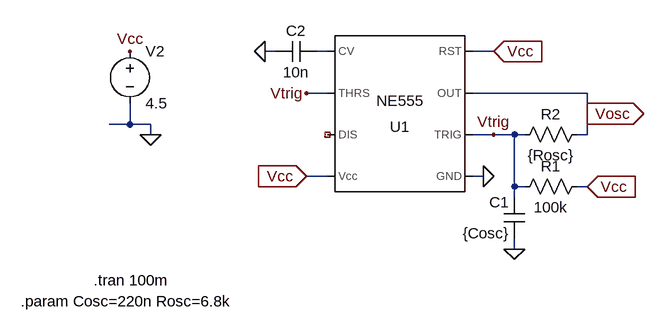
[diagram p0: schematic 555sim.asc]
555sim.asc, the LTspice schematic file:
Version 4
SHEET 1 880 680
WIRE 0 -32 -16 -32
WIRE 80 -32 64 -32
WIRE 336 -32 304 -32
WIRE 80 32 48 32
WIRE 480 32 304 32
WIRE 480 64 480 32
WIRE -224 80 -224 48
WIRE -224 80 -256 80
WIRE -192 80 -224 80
WIRE -192 96 -192 80
WIRE 336 96 304 96
WIRE 368 96 336 96
WIRE 384 96 368 96
WIRE 480 96 480 64
WIRE 480 96 464 96
WIRE 80 160 48 160
WIRE 320 160 304 160
WIRE 368 176 368 96
WIRE 384 176 368 176
WIRE 480 176 464 176
WIRE 368 192 368 176
WIRE 368 272 368 256
FLAG -192 96 0
FLAG -224 -32 Vcc
FLAG 336 -32 Vcc
IOPIN 336 -32 In
FLAG 48 160 Vcc
IOPIN 48 160 In
FLAG 480 64 Vosc
IOPIN 480 64 Out
FLAG 480 176 Vcc
IOPIN 480 176 In
FLAG 336 96 Vtrig
FLAG 48 32 Vtrig
FLAG 320 160 0
FLAG 368 272 0
FLAG -16 -32 0
SYMBOL voltage -224 -48 R0
WINDOW 123 0 0 Left 0
WINDOW 39 0 0 Left 0
SYMATTR InstName V2
SYMATTR Value 4.5
SYMBOL Misc\\NE555 192 64 R180
SYMATTR InstName U1
SYMBOL res 480 160 R90
WINDOW 0 0 56 VBottom 2
WINDOW 3 32 56 VTop 2
SYMATTR InstName R1
SYMATTR Value 100k
SYMBOL res 480 80 R90
WINDOW 0 0 56 VBottom 2
WINDOW 3 32 56 VTop 2
SYMATTR InstName R2
SYMATTR Value {Rosc}
SYMBOL cap 384 256 R180
WINDOW 0 24 56 Left 2
WINDOW 3 24 8 Left 2
SYMATTR InstName C1
SYMATTR Value {Cosc}
SYMBOL cap 64 -48 R90
WINDOW 0 0 32 VBottom 2
WINDOW 3 32 32 VTop 2
SYMATTR InstName C2
SYMATTR Value 10n
TEXT -280 320 Left 2 !.tran 100m
TEXT -392 352 Left 2 !.param Cosc=220n Rosc=6.8k

The netlist it stands for:
* 555sim.asc
V2 Vcc 0 4.5
XU1 0 Vtrig Vosc Vcc N001 Vtrig NC_01 Vcc NE555  ; pins GND TRIG OUT RST CV THRS DIS Vcc
R1 Vcc Vtrig 100k
R2 Vosc Vtrig {Rosc}
C1 0 Vtrig {Cosc}
C2 N001 0 10n
.tran 100m
.param Cosc=220n Rosc=6.8k
.lib NE555.sub
.backanno
.end